# EAGLE design H-BridgeAmpCore (EAGLE 7.1.0)
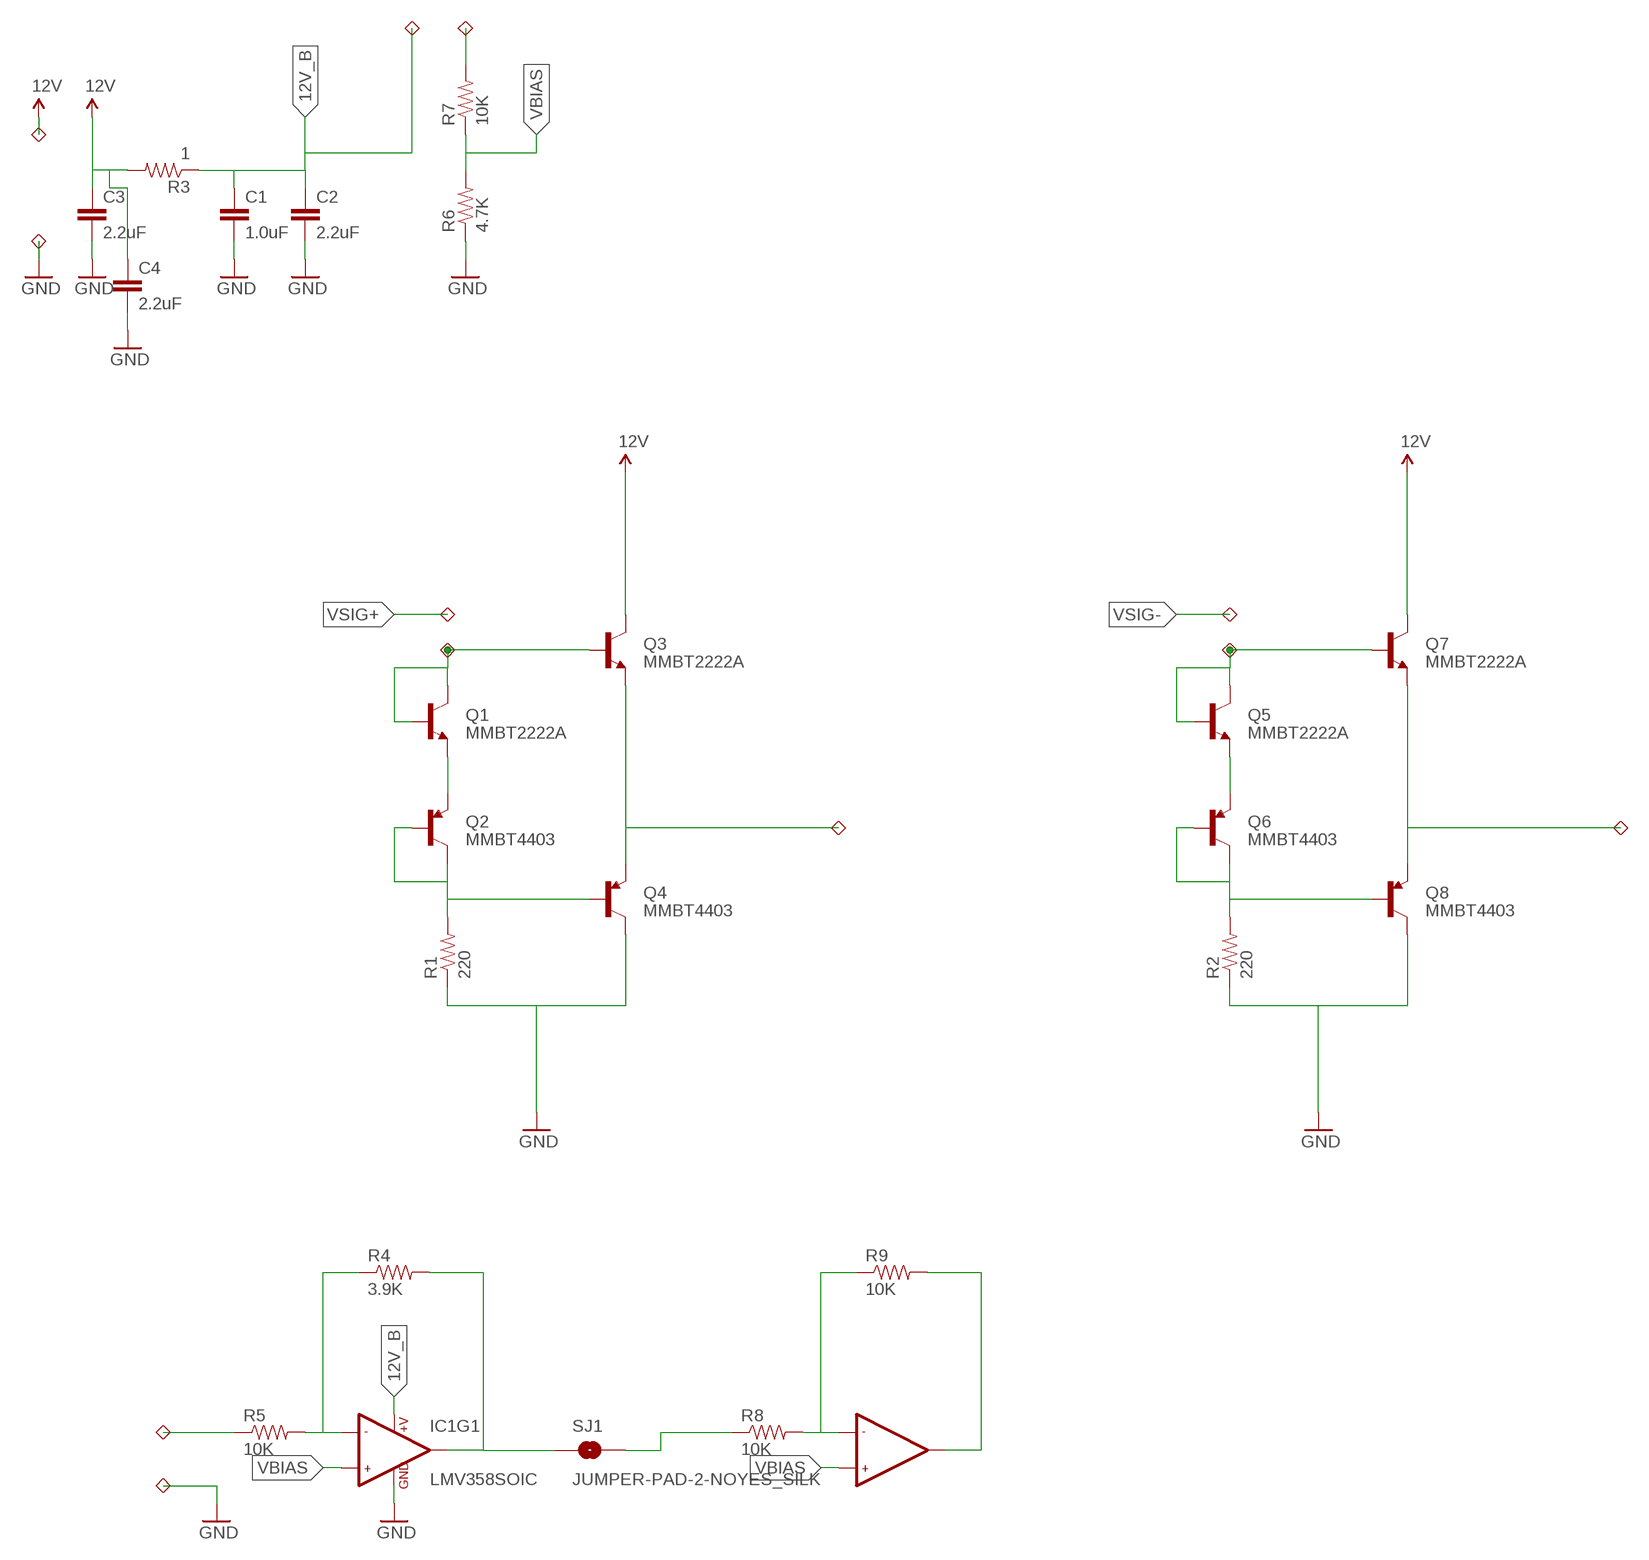
[diagram p0: schematic, sheet 1]

## Parts
C1  1.0uF  1.0UF-16V-10%(0603)  [0603-CAP]
C2  2.2uF  2.2UF-25V-+80/-20(0805)  [0805-CAP]
C3  2.2uF  2.2UF-25V-+80/-20(0805)  [0805-CAP]
C4  2.2uF  2.2UF-25V-+80/-20(0805)  [0805-CAP]
IC1  LMV358SOIC  [SO08]
Q1  MMBT2222A  TRANSISTOR_NPNMMBT2222A  [SOT23-3]
Q2  MMBT4403  TRANSISTOR_PNPMMBT4403  [SOT23-3]
Q3  MMBT2222A  TRANSISTOR_NPNMMBT2222A  [SOT23-3]
Q4  MMBT4403  TRANSISTOR_PNPMMBT4403  [SOT23-3]
Q5  MMBT2222A  TRANSISTOR_NPNMMBT2222A  [SOT23-3]
Q6  MMBT4403  TRANSISTOR_PNPMMBT4403  [SOT23-3]
Q7  MMBT2222A  TRANSISTOR_NPNMMBT2222A  [SOT23-3]
Q8  MMBT4403  TRANSISTOR_PNPMMBT4403  [SOT23-3]
R1  220  220OHM-1/10W-1%(0603)  [0603-RES]
R2  220  220OHM-1/10W-1%(0603)  [0603-RES]
R3  1  1OHM1/10W1%(0603)  [0603-RES]
R4  3.9K  3.9KOHM1/10W1%(0603)  [0603]
R5  10K  10KOHM-1/10W-1%(0603)0603  [0603-RES]
R6  4.7K  4.7KOHM-1/10W-1%(0603)  [0603-RES]
R7  10K  10KOHM-1/10W-1%(0603)0603  [0603-RES]
R8  10K  10KOHM-1/10W-1%(0603)0603  [0603-RES]
R9  10K  10KOHM-1/10W-1%(0603)0603  [0603-RES]
SJ1  JUMPER-PAD-2-NOYES_SILK  [PAD-JUMPER-2-NO_YES_SILK]
U$1  1PIN  [THUMBNAIL]
U$2  1PIN  [THUMBNAIL]
U$3  1PIN  [THUMBNAIL]
U$4  1PIN  [THUMBNAIL]
U$5  1PIN  [THUMBNAIL]
U$6  1PIN  [THUMBNAIL]
U$7  1PINMINI  [THUMBNAILMINI]
U$8  1PINMINI  [THUMBNAILMINI]
U$9  1PINMINI  [THUMBNAILMINI]
U$10  1PINMINI  [THUMBNAILMINI]
U$11  1PINMINI  [THUMBNAILMINI]
U$12  1PINMINI  [THUMBNAILMINI]

## Nets
12V: C3.1 C4.1 Q3.3(C) Q7.3(C) R3.2 U$5.P$1
12V_B: C1.1 C2.1 IC1.8(+V) R3.1 U$11.P$1
+IN: Q1.1(B) Q1.3(C) Q3.1(B) U$9.P$1
-IN: Q5.1(B) Q5.3(C) Q7.1(B) U$7.P$1
GND: C1.2 C2.2 C3.2 C4.2 IC1.4(GND) Q4.3(C) Q8.3(C) R1.1 R2.1 R6.1 U$4.P$1 U$6.P$1
N$3: R8.1 SJ1.2
N$4: Q6.1(B) Q6.3(C) Q8.1(B) R2.2
N$5: R7.2 U$12.P$1
N$6: Q2.1(B) Q2.3(C) Q4.1(B) R1.2
N$7: Q5.2(E) Q6.2(E)
N$8: Q1.2(E) Q2.2(E)
N$9: IC1.2(-IN1) R4.1 R5.2
N$11: IC1.6(-IN2) R8.2 R9.1
N$13: R5.1 U$3.P$1
OUT+: Q3.2(E) Q4.2(E) U$2.P$1
OUT-: Q7.2(E) Q8.2(E) U$1.P$1
VBIAS: IC1.3(+IN1) IC1.5(+IN2) R6.2 R7.1
VSIG+: IC1.1(OUT1) R4.2 SJ1.1 U$10.P$1
VSIG-: IC1.7(OUT2) R9.2 U$8.P$1

## Library data of the parts
C1 = SparkFun-Capacitors:1.0UF-16V-10%(0603): CAP-00868; PROD_ID: CAP-00868
C2-C4 = SparkFun-Capacitors:2.2UF-25V-+80/-20(0805): CAP-11624; PROD_ID: CAP-11624
IC1 = SparkFun-AnalogIC:LMV358: Jellybean rail-to-rail output op-amp; PROD_ID: IC-09657
Q1 Q3 Q5 Q7 = SparkFun-DiscreteSemi:TRANSISTOR_NPN: Generic NPN BJT MMBT2222A - TRANS-08049 (SOT-23, 1A 40V) MPSA42 - TRANS-09116 (SOT-23, 500mA 300V) MMBT5088LT1G - TRANS-11160 (SOT-23, 50 mA 30V) BC547 - COM-08928 <http://www.sparkfun.com/products/8928> (TO-92 45V 100mA) (1.Collector 2.Base 3.Emitter) 2N3904 - COM-00521 <http://www.sparkfun.com/products/521> (TO-92 40V 200mA) (1.Emitter 2.Base 3.Collector) P2N2222A - COM-12852 <http://www.sparkfun.com/products/12852> (TO-92 40V 600mA) (1.Collector 2.Base 3.Emitter); PROD_ID: TRANS-08049
Q2 Q4 Q6 Q8 = SparkFun-DiscreteSemi:TRANSISTOR_PNP: Generic PNP BJT Double check pinouts against datasheets- not all devices are the same! MMBT3906 - 40V 200mA SOT-23 (TRANS-08052) MMBT4403 - 40V 600mA SOT-23 (TRANS-09245); PROD_ID: TRANS-09245
R1 R2 = SparkFun-Resistors:220OHM-1/10W-1%(0603): RES-07861; PROD_ID: RES-07861
R3 = SparkFun-Resistors:1OHM1/10W1%(0603): RES-08269; PROD_ID: RES-08269
R4 = SparkFun-Resistors:3.9KOHM1/10W1%(0603): RES-08701; PROD_ID: RES-08701
R5 R7-R9 = SparkFun-Resistors:10KOHM-1/10W-1%(0603): RES-00824; PROD_ID: RES-00824
R6 = SparkFun-Resistors:4.7KOHM-1/10W-1%(0603): RES-07857; PROD_ID: RES-07857
SJ1 = SparkFun-Passives:JUMPER-PAD-2-NO
U$1-U$12 = multi-smt:1PIN

## Board
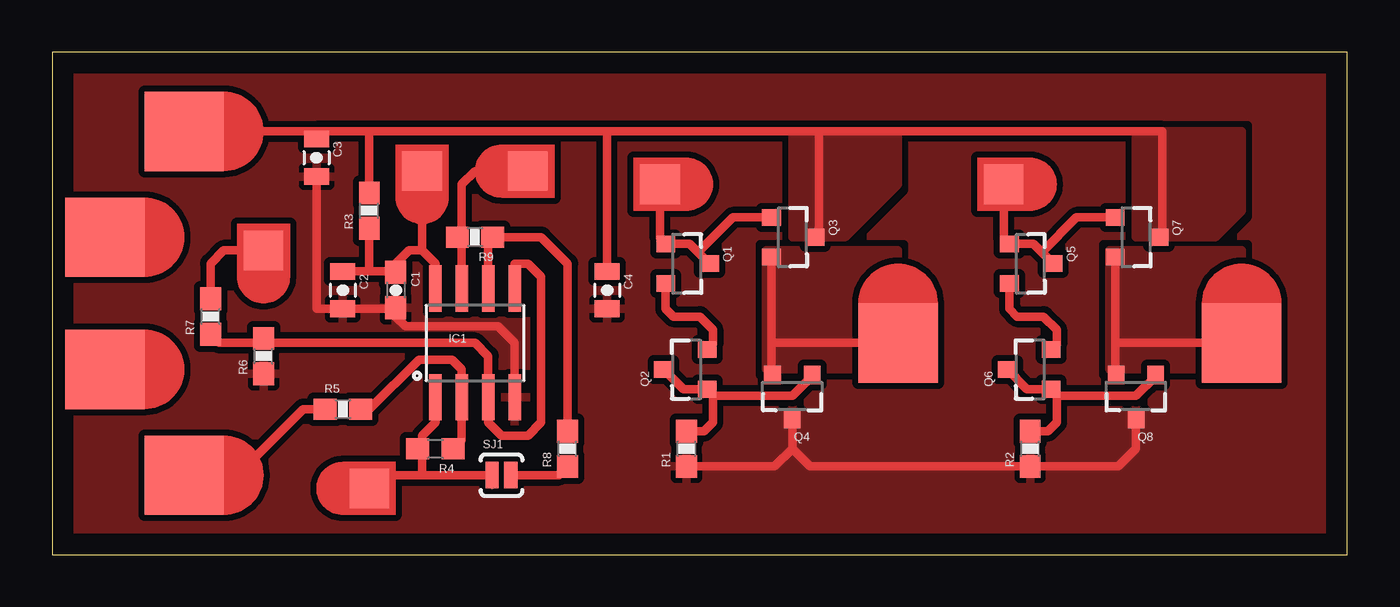
[diagram p1: board, top side]

Size 62.23 x 24.13 mm. Coordinates in mm from the lower left corner, seen from the top.
Outline: 0,0 62.23,0 62.23,24.13 0,24.13 0,0
Copper layers (1*16): Top 0.035mm / dielectric 1.5mm / Bottom 0.035mm
Design rules "default *": minimum track width 10mil, minimum drill 24mil, track to track 12mil, track to pad 12mil, pad to pad 12mil, via to via 12mil, smd to smd 8mil, copper to edge 40mil, drill to drill 8mil, minimum pad ring 10mil, minimum via ring 8mil, stop-mask expansion 4mil, vias tented up to drill 0mil, thermal gap 10mil

### Footprints (pad centres in the part's own frame; a part is rotated, then mirrored left to right if it is on the bottom)
0603-CAP = smd 1.1 x 1: 1 -0.85,0; 2 0.85,0
0805-CAP = smd 0.8 x 1.2: 1 -0.9,0; 2 0.9,0
SO08 = smd 0.61 x 2.21: 1 -1.905,-2.616; 2 -0.635,-2.616; 3 0.635,-2.616; 4 1.905,-2.616; 5 1.905,2.616; 6 0.635,2.616; 7 -0.635,2.616; 8 -1.905,2.616
SOT23-3 = smd 0.8 x 0.9: 1 -0.95,-1; 2 0.95,-1; 3 0,1.1
0603-RES = smd 1.1 x 1: 1 -0.85,0; 2 0.85,0
0603 = smd 1.1 x 1: 1 -0.85,0; 2 0.85,0
PAD-JUMPER-2-NO_YES_SILK = smd 0.635 x 1.27: 1 -0.45,0; 2 0.45,0
THUMBNAIL = smd 3.81 x 3.81: P$1 0,0
THUMBNAILMINI = smd 1.905 x 1.905: P$1 0,0

### Placement (x,y rotation side)
C1  16.51,12.7 270 top
C2  13.97,12.7 270 top
C3  12.7,19.05 270 top
C4  26.67,12.7 270 top
IC1  20.32,10.16 0 top
Q1  30.48,13.97 270 top
Q2  30.48,8.89 90 top
Q3  35.56,15.24 270 top
Q4  35.56,7.62 180 top
Q5  46.99,13.97 270 top
Q6  46.99,8.89 90 top
Q7  52.07,15.24 270 top
Q8  52.07,7.62 180 top
R1  30.48,5.08 90 top
R2  46.99,5.08 90 top
R3  15.24,16.51 90 top
R4  18.41,5.08 180 top
R5  13.97,6.99 0 top
R6  10.16,9.53 90 top
R7  7.62,11.43 90 top
R8  24.77,5.08 90 top
R9  20.32,15.24 180 top
SJ1  21.59,3.81 0 top
U$1  57.15,10.16 90 top
U$2  40.64,10.16 90 top
U$3  6.35,3.81 0 top
U$4  2.54,8.89 0 top
U$5  6.35,20.32 0 top
U$6  2.54,15.24 0 top
U$7  45.72,17.78 0 top
U$8  22.86,18.41 180 top
U$9  29.21,17.78 0 top
U$10  15.24,3.17 180 top
U$11  17.78,18.41 270 top
U$12  10.16,14.61 270 top

### Tracks (layer width: path | path; a pad name or v marks a point on that pad's centre or on a via)
12V
  Top 0.406: U$5.P$1 12.7,20.32 | 12.7,20.32 C3.1 | Q7.3 53.34,15.24 53.34,20.32 36.83,20.32 | Q3.3 36.83,15.41 36.83,20.32 | 36.83,20.32 26.67,20.32 | 26.67,20.32 15.24,20.32 | 15.24,20.32 12.7,20.32 | R3.2 15.24,20.32 | C4.1 26.67,20.32
  pour Top (no thermals): 35.56,20.32 35.56,15.24 38.1,15.24 40.64,17.78 40.64,20.32
  pour Top (no thermals): 52.07,20.32 52.07,15.24 54.61,15.24 55.88,15.24 57.15,16.51 57.15,20.32
12V_B
  Top 0.406: C2.1 15.24,13.6 | 15.24,13.6 16.46,13.6 C1.1 16.51,13.97 17.14,14.61 17.78,14.61 | R3.1 15.24,13.6 | IC1.8 18.41,13.97 17.78,14.61 | U$11.P$1 17.78,14.61
+IN
  Top 0.406: U$9.P$1 29.21,15.19 Q1.1 30.63,14.92 31.03,14.52 | 31.03,14.52 Q1.3 | Q3.1 32.7,16.19 31.03,14.52
-IN
  Top 0.406: U$7.P$1 45.72,15.19 Q5.1 47.14,14.92 47.54,14.52 | 47.54,14.52 Q5.3 | Q7.1 49.21,16.19 47.54,14.52
GND
  Top 0.406: C3.2 12.7,11.8 C2.2 16.51,11.8 C1.2 16.51,11.43 16.99,10.95 21.43,10.95 22.23,10.16 IC1.4 | Q8.3 52.07,5.08 51.22,4.23 R2.1 36.41,4.23 35.56,5.08 | R1.1 34.71,4.23 35.56,5.08 | 35.56,5.08 Q4.3
  pour Top (rank 2): 0,24.13 62.23,24.13 62.23,0 0,0
  pour Top (no thermals): 36.83,5.08 36.83,6.83 34.29,6.83 34.29,5.08
  pour Top (no thermals): 53.34,5.08 53.34,6.83 50.8,6.83 50.8,5.08
N$3
  Top 0.406: SJ1.2 24.34,3.81 R8.1
N$4
  Top 0.406: R2.2 47.84,5.93 48.26,6.35 48.26,7.67 Q6.1 | Q8.1 53.02,8.57 52.07,7.62 48.31,7.62 Q6.1 | Q6.3 46.84,7.94 Q6.1
N$5
  Top 0.406: U$12.P$1 8.26,14.61 7.62,13.97 R7.2
N$6
  Top 0.406: Q2.1 30.33,7.94 Q2.3 | Q4.1 36.51,8.57 35.56,7.62 31.8,7.62 Q2.1 | R1.2 31.33,5.93 31.75,6.35 31.75,7.67 Q2.1
N$7
  Top 0.406: Q5.2 45.99,11.79 46.35,11.43 47.62,11.43 48.26,10.79 48.26,10.11 Q6.2
N$8
  Top 0.406: Q1.2 29.48,11.79 29.84,11.43 31.11,11.43 31.75,10.79 31.75,10.11 Q2.2
N$9
  Top 0.406: R4.1 19.68,5.5 IC1.2 19.68,8.89 19.21,9.37 17.62,9.37 15.24,6.99 R5.2
N$11
  Top 0.406: IC1.6 20.95,15.03 | 20.95,15.03 20.95,15.24 R9.1 | 20.95,15.03 R9.1 | R8.2 24.77,13.97 23.5,15.24 R9.1
N$13
  Top 0.406: U$3.P$1 8.89,3.81 12.06,6.99 R5.1
OUT+
  Top 0.406: Q3.2 34.56,10.16 | 34.56,10.16 34.56,8.67 Q4.2 | U$2.P$1 34.56,10.16
  pour Top (no thermals): 34.29,14.61 34.29,8.89 40.64,8.89 40.64,14.61
OUT-
  Top 0.406: Q7.2 51.07,10.16 | 51.07,10.16 51.07,8.67 Q8.2 | U$1.P$1 51.07,10.16
  pour Top (no thermals): 50.8,14.61 50.8,8.89 57.15,8.89 57.15,14.61
VBIAS
  Top 0.406: IC1.5 22.23,13.97 22.86,13.97 23.5,13.34 23.5,6.35 22.86,5.71 21.59,5.71 20.95,6.35 IC1.3 20.95,9.53 20.32,10.16 10.38,10.16 R6.2 9.95,10.16 8.04,10.16 R7.1
VSIG+
  Top 0.406: IC1.1 18.41,6.35 17.78,5.71 17.78,5.29 R4.2 17.78,4.87 17.78,3.81 | 21.14,3.36 SJ1.1 17.78,3.81 | U$10.P$1 15.88,3.81 17.78,3.81
VSIG-
  Top 0.406: R9.2 19.68,15.03 IC1.7 19.68,17.78 20.32,18.41 U$8.P$1